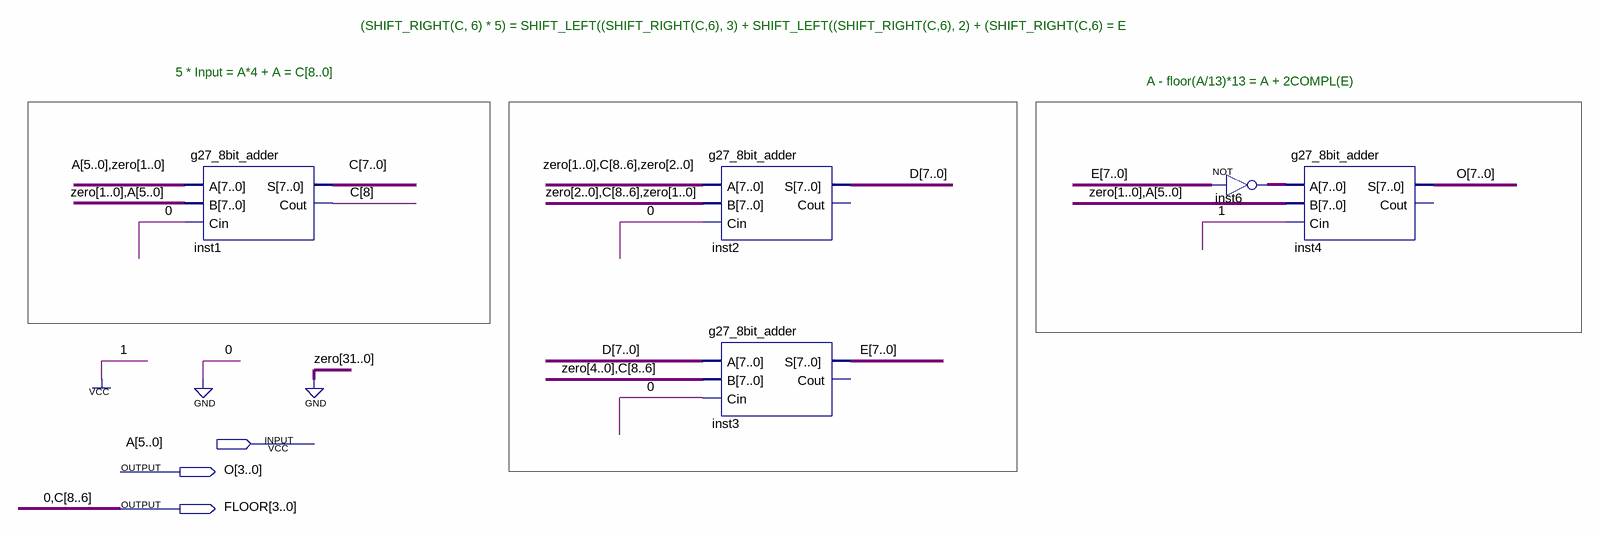
[diagram p0: schematic sheet]
// Quartus schematic g27_Modulo_13.bdf as structural Verilog: 5 symbols, 3 pins
module g27_Modulo_13 (
  input  [5:0] A,
  output [7:0] O,
  output [3:0] FLOOR
);

  wire [5:0] C;
  wire [7:0] D, E, inst6_out;

  g27_8bit_adder inst1 (.A({A, 2'b00}), .B({2'b00, A}), .Cin(1'b0), .S({FLOOR[1:0], C}), .Cout(FLOOR[2]));
  g27_8bit_adder inst2 (
    .A({2'b00, FLOOR[2:0], 3'b000}), .B({3'b000, FLOOR[2:0], 2'b00}), .Cin(1'b0), .S(D));  // open: Cout
  g27_8bit_adder inst3 (.A(D), .B({{5{1'b0}}, FLOOR[2:0]}), .Cin(1'b0), .S(E));  // open: Cout
  assign inst6_out = ~E;  // NOT inst6, 8 bits wide
  g27_8bit_adder inst4 (.A(inst6_out), .B({2'b00, A}), .Cin(1'b1), .S(O));  // open: Cout

  assign FLOOR[3] = 1'b0;

  // Other names for the same wires on the sheet: C[8:6] = FLOOR[2:0]

  // Notes on the sheet:
  //   (SHIFT_RIGHT(C, 6) * 5) = SHIFT_LEFT((SHIFT_RIGHT(C,6), 3) + SHIFT_LEFT((SHIFT_RIGHT(C,6), 2) + (SHIFT_RIGHT(C,6) = E                                         
  //   5 * Input = A*4 + A = C[8..0]              
  //   A - floor(A/13)*13 = A + 2COMPL(E)                  
endmodule
